# Altium schematic sheet board_schematic.SchDoc
size A4; SheetNumber: 1; SheetTotal: 1
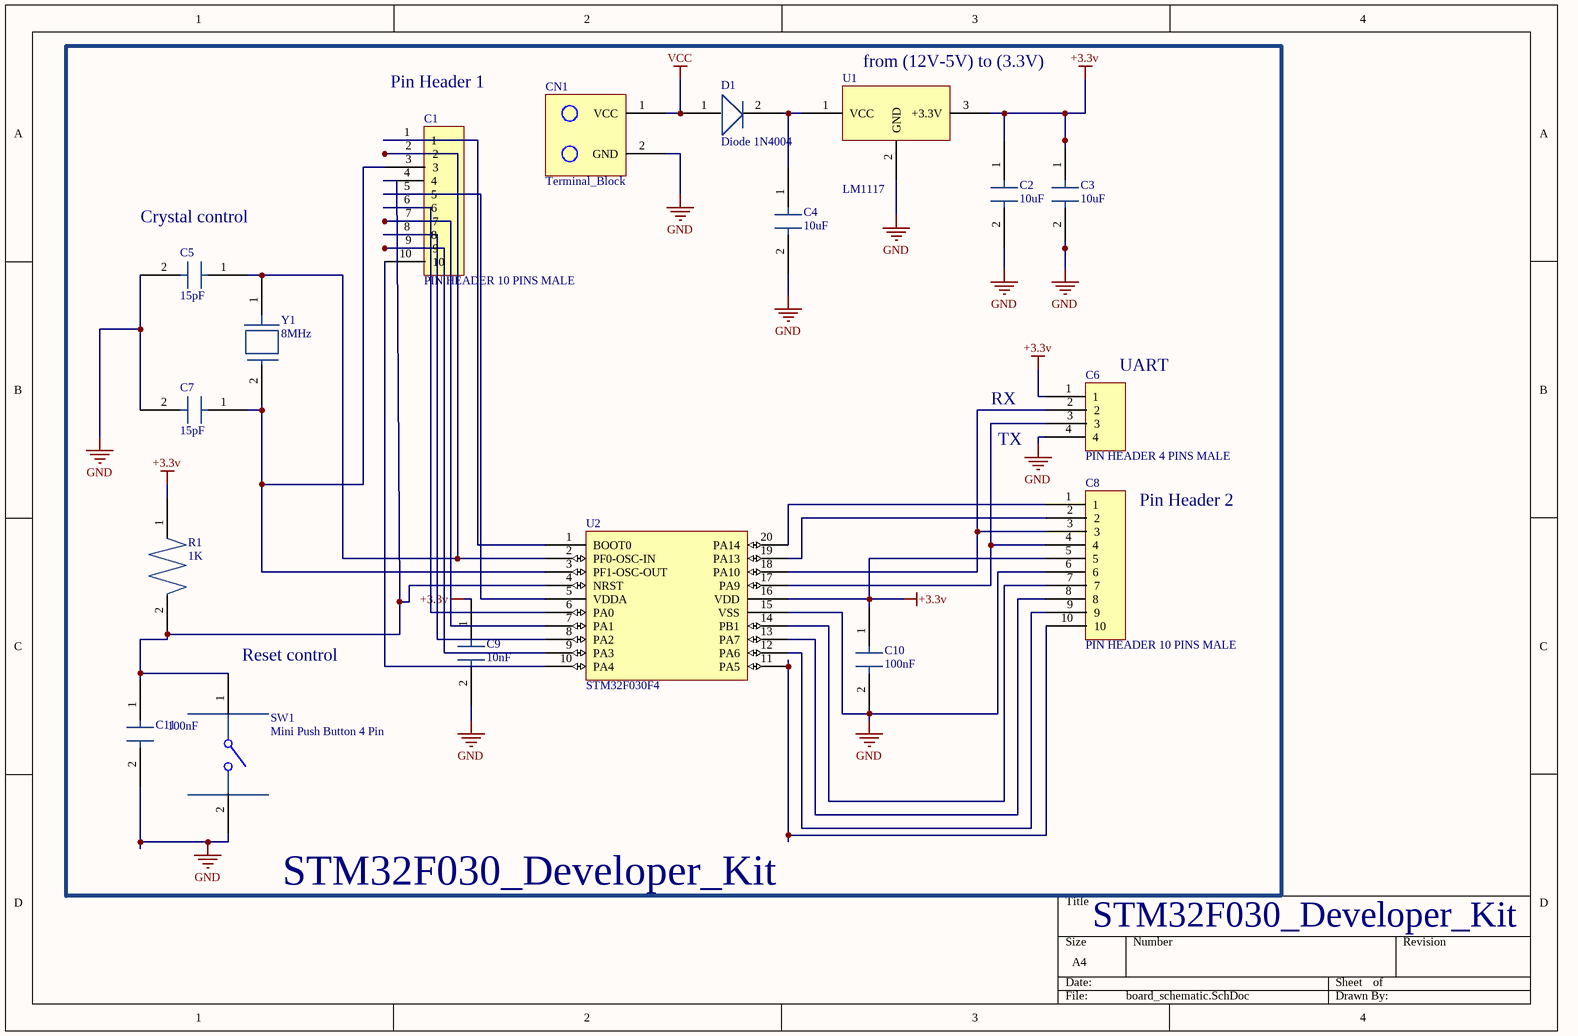
[diagram p0: board_schematic.SchDoc]

## Parts
C1  PIN HEADER 10 PINS MALE  [PIN HEADER 10 PINS MALE]
C2  10uF  [CAP 220nF SMD]
C3  10uF  [CAP 220nF SMD]
C4  10uF  [CAP 220nF SMD]
C5  15pF  [CAP 15pF SMD]
C6  PIN HEADER 4 PINS MALE  [PIN HEADER 4 PINS MALE]
C7  15pF  [CAP 15pF SMD]
C8  PIN HEADER 10 PINS MALE  [PIN HEADER 10 PINS MALE]
C9  10nF  [CAP 220nF SMD]
C10  100nF  [CAP 100nF SMD]
C11  100nF  [CAP 100nF SMD]
CN1  Terminal_Block  [TerminalBlock_2pins]
D1  Diode 1N4004  [Diode 1N4004]
R1  1K  [RES 10K SMD]
SW1  Mini Push Button 4 Pin  [Mini Push Button 4 Pin]
U1  LM1117  [LM1117]
U2  STM32F030F4  [STM32F030F4P6TR]
Y1  8MHz  [Crystal 8MHz]

## Nets
+3.3v: C2.1 C3.1 C6.1 C8.5 C9.1 C10.1 R1.1 U1.3(+3.3V) U2.16(VDD)
GND: C2.2 C3.2 C4.2 C5.2 C6.4 C7.2 C8.6 C9.2 C10.2 C11.2 CN1.2(GND) SW1.2 U1.2(GND) U2.15(VSS)
VCC: CN1.1(VCC) D1.1
NetC1_1: C1.1 U2.1(BOOT0)
NetC1_2: C1.2 C5.1 U2.2(PF0-OSC-IN) Y1.1
NetC1_3: C1.3 C7.1 U2.3(PF1-OSC-OUT) Y1.2
NetC1_4: C1.4 C11.1 R1.2 SW1.1 U2.4(NRST)
NetC1_5: C1.5 U2.5(VDDA)
NetC1_6: C1.6 U2.6(PA0)
NetC1_7: C1.7 U2.7(PA1)
NetC1_8: C1.8 U2.8(PA2)
NetC1_9: C1.9 U2.9(PA3)
NetC1_10: C1.10 U2.10(PA4)
NetC4_1: C4.1 D1.2 U1.1(VCC)
NetC6_2: C6.2 C8.3 U2.18(PA10)
NetC6_3: C6.3 C8.4 U2.17(PA9)
NetC8_1: C8.1 U2.20(PA14)
NetC8_2: C8.2 U2.19(PA13)
NetC8_7: C8.7 U2.14(PB1)
NetC8_8: C8.8 U2.13(PA7)
NetC8_9: C8.9 U2.12(PA6)
NetC8_10: C8.10 U2.11(PA5)

## Notes on the sheet
- (near C1) Pin Header 1
- (near U1) from (12V-5V) to (3.3V)
- (near C5) Crystal control
- (near C6) UART
- RX
- TX
- Pin Header 2
- (near SW1) Reset control
- STM32F030_Developer_Kit

## Library data of the parts
C1 C8 = PIN HEADER 10 PINS MALE: Through Hole 1way 10pins; manufacturer: ZHOURI; manufacturer part number: 2.54-1*10; supplier: Makers electronics; supplier part number: 34963000697510
C2-C4 = CAP 10uF SMD: 25V 10uF Y5V ±10% 1206 Multilayer Ceramic Capacitors MLCC – SMD/SMT ROHS; manufacturer: CCTC; manufacturer part number: TCC1206X5R106K250HT; supplier: Makers electronics; supplier part number: 2168949689378
C5 C7 = CAP 15pF SMD: 50V 15pF C0G ±5% 0603 Multilayer Ceramic Capacitors MLCC – SMD/SMT ROHS– SMD/SMT ROHS; manufacturer: CCTC; manufacturer part number: TCC0603COG150J500CT; supplier: Makers electronics; supplier part number: 4797906887618
C6 = PIN HEADER 4 PINS MALE: Through Hole 1way 4pins; manufacturer: ZHOURI; manufacturer part number: 2.54-1*4; supplier: Makers electronics; supplier part number: 34963000697510
C9 = CAP 10nF SMD: 50V 10nF X7R ±10% 1206 Multilayer Ceramic Capacitors MLCC – SMD/SMT ROHS; manufacturer: CCTC; manufacturer part number: TCC1206X7R103K500DT; supplier: Makers electronics; supplier part number: 34963000814010
C10 C11 = CAP 100nF SMD: 16V 100nF X7R ±10% 0402 Multilayer Ceramic Capacitors MLCC – SMD/SMT ROHS; manufacturer: Samsung Electro-Mechanics; manufacturer part number: CL05B104KO5NNNC; supplier: Makers electronics; supplier part number: 7283127875093
CN1 = Terminal_Block: Manufacturer: CUI Devices; Manufacturer Part Number: TB002-500-02BE; Supplier: Makers Electronics; Supplier Part Number: 1215363384929
D1 = Diode 1N4004: Single 1A 1.1V@1A 400V SMA Diodes – General Purpose ROHS; Manufacturer: YONGYUTAI; Manufacturer part number: 1N4004; Supplier: Makers electronics; Supplier part number: 3496300071791
R1 = RES 1K SMD: Chip Resistor SMD 1KΩ ±5% 1W ±100ppm/℃ 2512; Manufacturer: FOJAN; Manufacturer part number: FRC2512J103 TS; Supplier: Makers electronics; Supplier part number: 3496300080755
SW1 = Mini Push Button 4 Pin: 6x6x7mm Tactile 4 Pin Push Button Switch; manufacturer: HYP (Hongyuan Precision); anufacturer part number: 1TS005F-2500-5001; supplier: Makers electronics; supplier part number: 3496300083299
U1 = LM1117: 3.3 SOT-233 Linear Voltage Regulators (LDO) 3.3V  Output Current 800mA; manufacturer: National semiconductors; manufactuerer part number: LM1117; supplier: Makers electronics; supplier part number: 34963000647010
U2 = STM32F030F4: . TSSOP20 20-pin package pinout; manufacturer: STMicroelectronics; manufacturer part number: STM32F030F4P6TR; supplier: LCSC ELECTRONICS; supplier part number: C89040
Y1 = Crystal 8.000MHz: Crystal 8.000MHz 49S 20PPM 20pF 40Ω; manufacturer: HUIYUAN Crystal; manufacturer part number: HY8M49SOB2T02; supplier: Makers Electronics; supplier part number: 7006618269054